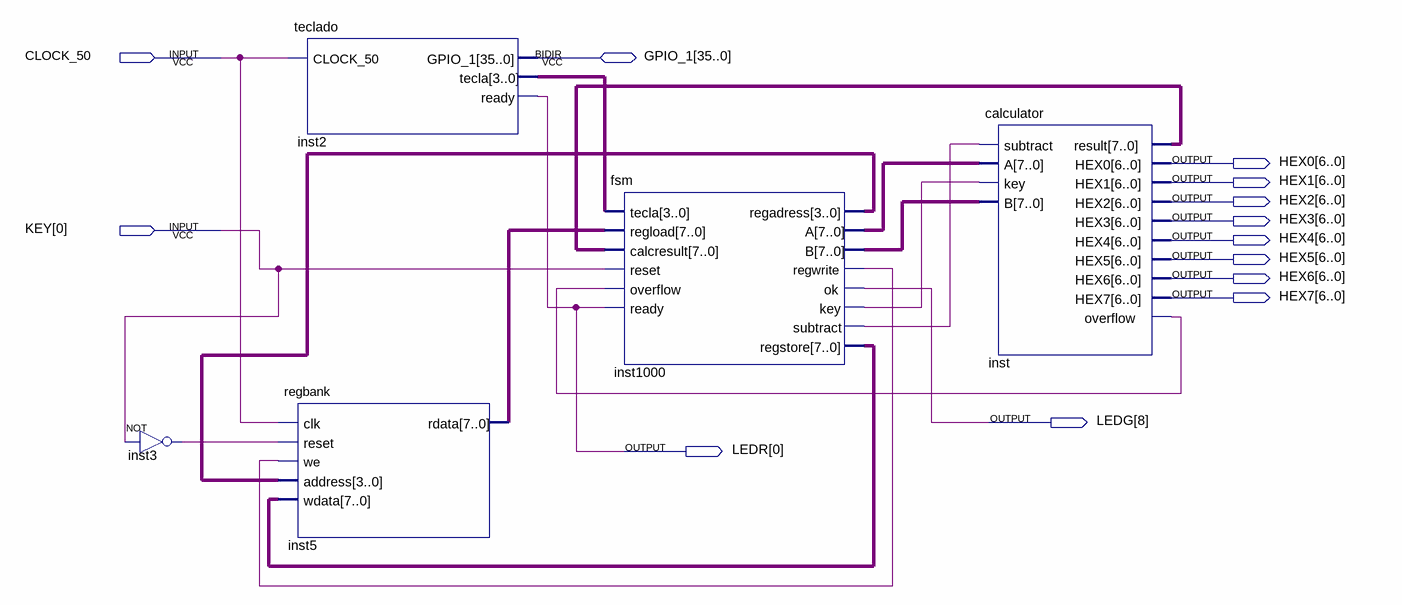
[diagram p0: schematic sheet]
// Quartus schematic projeto.bdf as structural Verilog: 5 symbols, 13 pins
module projeto (
  input  CLOCK_50,
  input  [0:0] KEY,
  inout  [35:0] GPIO_1,
  output [6:0] HEX0,
  output [6:0] HEX1,
  output [6:0] HEX2,
  output [6:0] HEX3,
  output [6:0] HEX4,
  output [6:0] HEX5,
  output [6:0] HEX6,
  output [6:0] HEX7,
  output [8:8] LEDG,
  output [0:0] LEDR
);

  wire inst3_out, inst1000_key, inst1000_regwrite, inst1000_subtract, inst_overflow;
  wire [3:0] inst2_tecla, inst1000_regadress;
  wire [7:0] inst5_rdata, inst1000_a, inst1000_b, inst1000_regstore, inst_result;

  not inst3 (inst3_out, KEY[0]);
  regbank inst5 (
    .clk(CLOCK_50), .reset(inst3_out), .we(inst1000_regwrite), .address(inst1000_regadress),
    .wdata(inst1000_regstore), .rdata(inst5_rdata));
  teclado inst2 (.CLOCK_50(CLOCK_50), .tecla(inst2_tecla), .ready(LEDR[0]), .GPIO_1(GPIO_1));
  fsm inst1000 (
    .tecla(inst2_tecla), .regload(inst5_rdata), .calcresult(inst_result), .reset(KEY[0]),
    .overflow(inst_overflow), .ready(LEDR[0]), .regadress(inst1000_regadress), .A(inst1000_a),
    .B(inst1000_b), .regwrite(inst1000_regwrite), .ok(LEDG[8]), .key(inst1000_key),
    .subtract(inst1000_subtract), .regstore(inst1000_regstore));
  calculator inst (
    .subtract(inst1000_subtract), .A(inst1000_a), .key(inst1000_key), .B(inst1000_b), .result(inst_result),
    .HEX0(HEX0), .HEX1(HEX1), .HEX2(HEX2), .HEX3(HEX3), .HEX4(HEX4), .HEX5(HEX5), .HEX6(HEX6), .HEX7(HEX7),
    .overflow(inst_overflow));
endmodule
